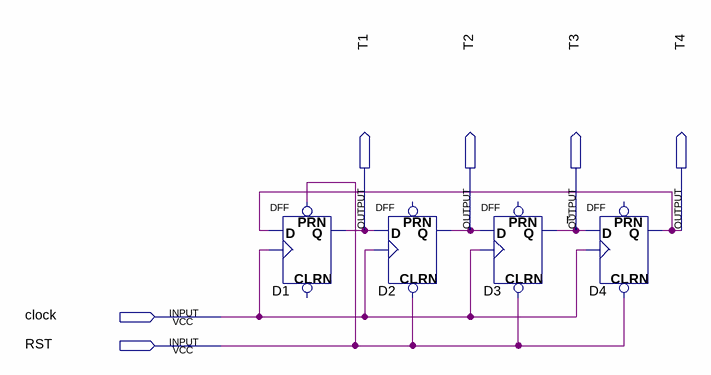
[diagram p0: schematic sheet]
// Quartus schematic experiment11.bdf as structural Verilog: 4 symbols, 6 pins
module experiment11 (
  input  clock,
  input  RST,
  output T1,
  output T2,
  output T3,
  output T4
);

  DFF D1 (.CLK(clock), .D(T4), .PRN(RST), .Q(T1));  // open: CLRN
  DFF D2 (.CLRN(RST), .CLK(clock), .D(T1), .Q(T2));  // open: PRN
  DFF D3 (.CLRN(RST), .CLK(clock), .D(T2), .Q(T3));  // open: PRN
  DFF D4 (.CLRN(RST), .CLK(clock), .D(T3), .Q(T4));  // open: PRN

  // Other names for the same wires on the sheet: r = T3
endmodule
